# EAGLE design buttons (EAGLE 7.7.0)
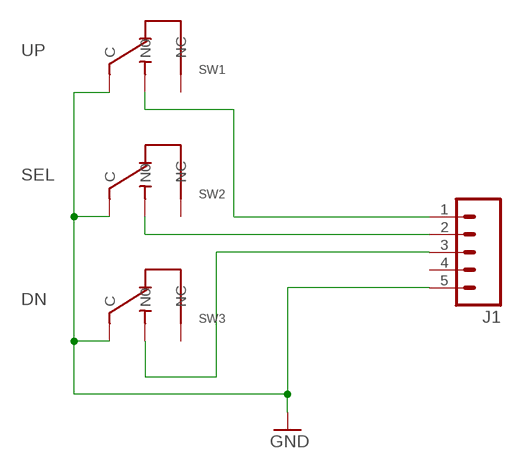
[diagram p0: schematic, sheet 1]

## Parts
J1  M05PTH  [1X05]
SW1  MICROSWITCH  [MICROSWITCH]
SW2  MICROSWITCH  [MICROSWITCH]
SW3  MICROSWITCH  [MICROSWITCH]

## Nets
GND: J1.5 SW1.C SW2.C SW3.C
N$2: J1.1 SW1.NO(N0)
N$3: J1.3 SW3.NO(N0)
N$4: J1.2 SW2.NO(N0)
Unconnected: J1.4 SW1.NC SW2.NC SW3.NC

## Notes on the sheet
- UP
- SEL
- DN

## Library data of the parts
J1 = SparkFun-Connectors:M05: Header 5 Standard 5-pin 0.1" header. Use with straight break away headers (SKU : PRT-00116), right angle break away headers (PRT-00553), swiss pins (PRT-00743), machine pins (PRT-00117), and female headers (PRT-00115). Molex polarized connector foot print use with SKU : PRT-08230 with associated crimp pins and housings.
SW1-SW3 = microswitch:MICROSWITCH

## Board
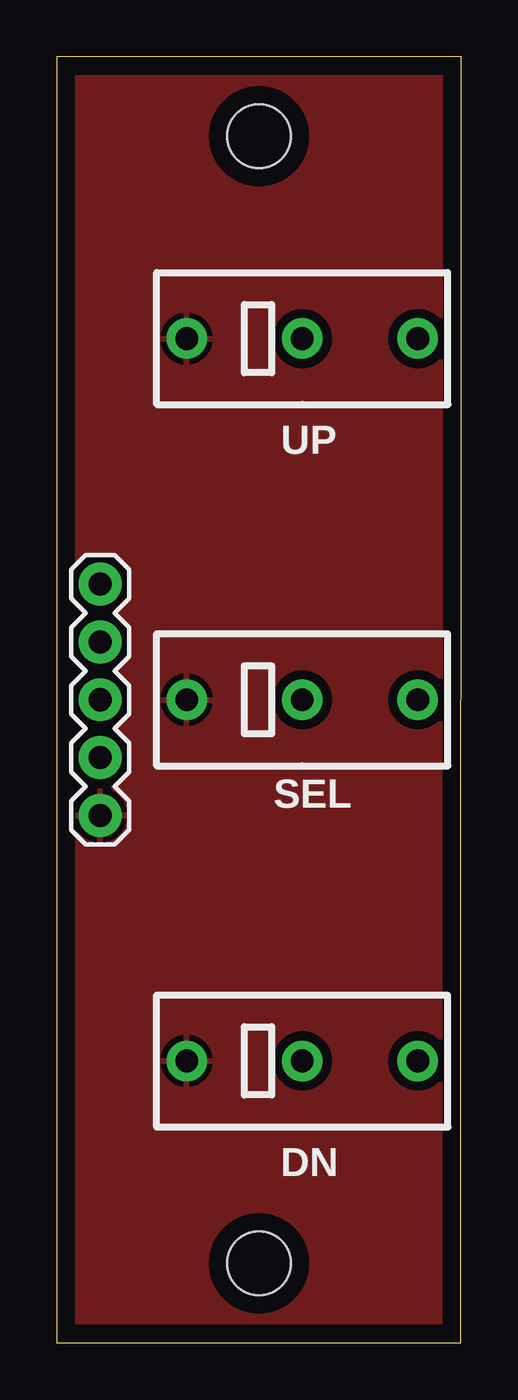
[diagram p1: board, top side]
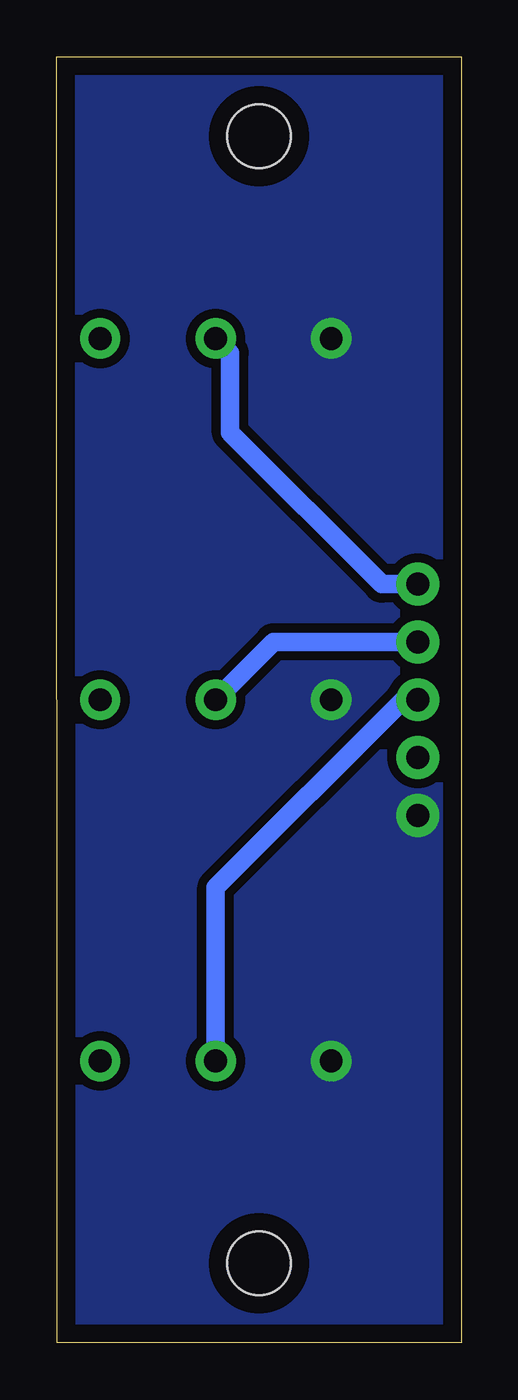
[diagram p2: board, bottom side, seen from below]

Size 17.78 x 56.52 mm. Coordinates in mm from the lower left corner, seen from the top.
Outline: 0,0 17.76,0 17.78,56.52 0,56.52 0,0
Copper layers (1*16): Top 0.035mm / dielectric 1.5mm / Bottom 0.035mm
Design rules "default *": minimum track width 10mil, minimum drill 24mil, track to track 0.4mm, track to pad 0.4mm, pad to pad 0.4mm, via to via 0.4mm, smd to smd 0.4mm, copper to edge 0.8mm, drill to drill 0.4mm, minimum pad ring 10mil, minimum via ring 8mil, stop-mask expansion 4mil, vias tented up to drill 0mil, thermal gap 10mil
Holes 2.8 mm at 8.89,3.49 8.89,53.02

### Footprints (pad centres in the part's own frame; a part is rotated, then mirrored left to right if it is on the bottom)
1X05 = drill 1.016 pad 1.88: 1 0,0; 2 2.54,0; 3 5.08,0; 4 7.62,0; 5 10.16,0
MICROSWITCH = drill 1 pad 1.778: C 0,0; NC 10.16,0; NO 5.08,0

### Placement (x,y rotation side)
J1  1.91,33.34 270 top
SW1  5.71,44.13 0 top
SW2  5.71,28.26 0 top
SW3  5.71,12.38 0 top

### Tracks (layer width: path | path; a pad name or v marks a point on that pad's centre or on a via)
GND
  pour Bottom (isolate 0.406, no thermals): 0,56.52 17.78,56.52 17.78,0 0,0
  pour Top (isolate 0.406): -0.32,56.83 18.1,56.83 18.1,-0.32 -0.32,-0.32
N$2
  Bottom 0.813: J1.1 3.49,33.34 10.16,40.01 10.16,43.5 SW1.NO
N$3
  Bottom 0.813: J1.3 2.54,28.26 10.79,20 SW3.NO
N$4
  Bottom 0.813: J1.2 8.25,30.8 SW2.NO

### Text on the board
tPlace: UP | SEL | DN